# Altium schematic sheet contrl.SchDoc
size A4
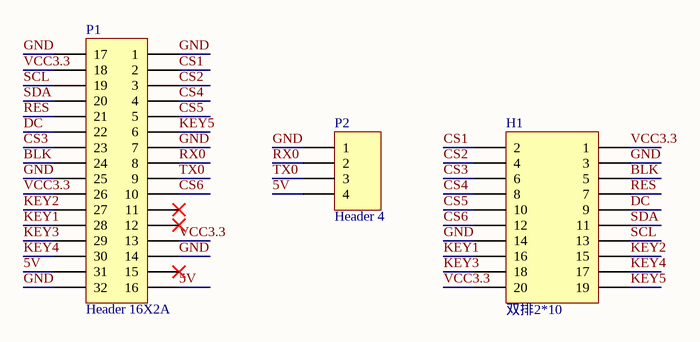
[diagram p0: contrl.SchDoc]

## Parts
H1  双排2*10  [20pin]
P1  Header 16X2A  [合宙esp32-c3开发板底座]
P2  Header 4  [HDR1X4]

## Nets
5V: P1.16 P1.31 P2.4
BLK: H1.5 P1.24
CS1: H1.2 P1.2
CS2: H1.4 P1.3
CS3: H1.6 P1.23
CS4: H1.8 P1.4
CS5: H1.10 P1.5
CS6: H1.12 P1.10
DC: H1.9 P1.22
GND: H1.3 H1.14 P1.1 P1.7 P1.14 P1.17 P1.25 P1.32 P2.1
KEY1: H1.16 P1.28
KEY2: H1.15 P1.27
KEY3: H1.18 P1.29
KEY4: H1.17 P1.30
KEY5: H1.19 P1.6
RES: H1.7 P1.21
RX0: P1.8 P2.2
SCL: H1.13 P1.19
SDA: H1.11 P1.20
TX0: P1.9 P2.3
VCC3.3: H1.1 H1.20 P1.13 P1.18 P1.26

Not connected (* = marked no-connect by the designer): P1 11* 12* 15*

## Library data of the parts
P1 = Header 16X2A: Header, 16-Pin, Dual row; LatestRevisionDate: 17-Jul-2002; LatestRevisionNote: Re-released for DXP Platform.; Publisher: Altium Limited
P2 = Header 4: Header, 4-Pin; LatestRevisionDate: 17-Jul-2002; LatestRevisionNote: Re-released for DXP Platform.; Publisher: Altium Limited